# Altium schematic sheet Gestión_Alimentación.SchDoc
size A4; SheetNumber: 9; SheetTotal: 10
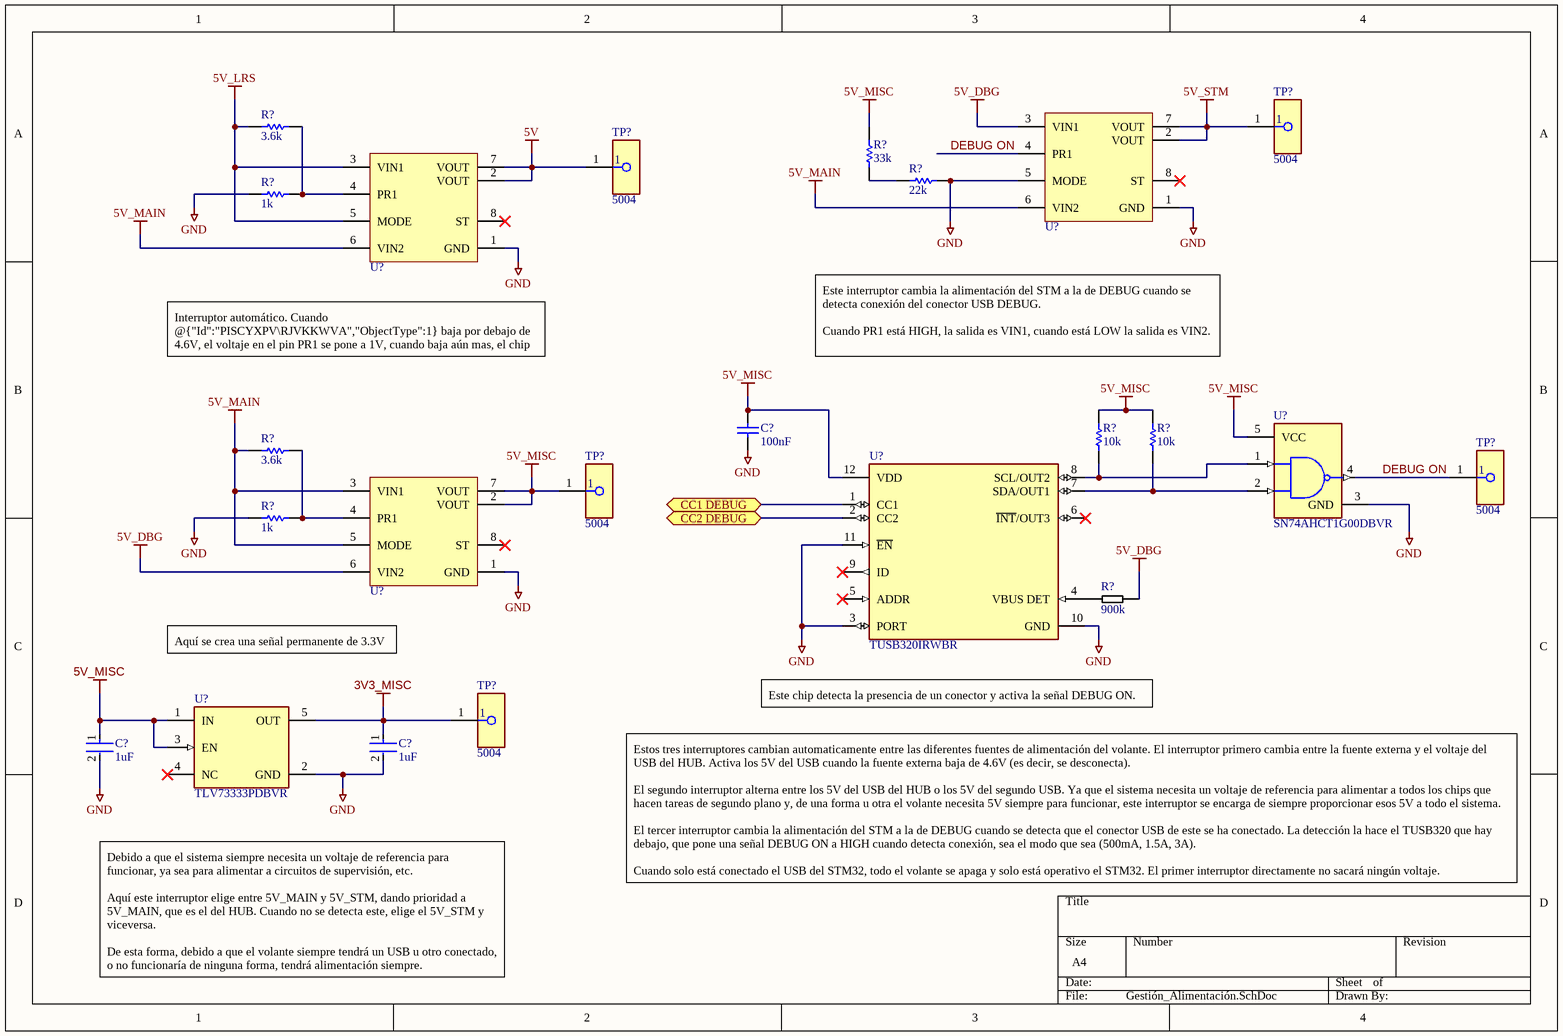
[diagram p0: Gestión_Alimentación.SchDoc]

## Parts
(Parts that share a designator on the sheet are numbered #1, #2 ... from top to bottom, then left to right.)
C?#1  100nF  [CAPC1005X55X25NL05T05]
C?#2  1uF  [FP-C0402C-BB-IPC_B]
C?#3  1uF  [FP-C0402C-BB-IPC_B]
R?#1  3.6k  [RESC1005X40X25ML10T10]
R?#2  33k  [RESC1005X40X25NL10T10]
R?#3  22k  [RESC1005X40X25NL10T10]
R?#4  1k  [RESC1005X40X25NL05T05]
R?#5  3.6k  [RESC1005X40X25ML10T10]
R?#6  10k  [RESC1005X40X25ML05T05]
R?#7  10k  [RESC1005X40X25ML05T05]
R?#8  1k  [RESC1005X40X25NL05T05]
R?#9  900k  [RES 1206]
TP?#1  5004  [FP-5004-MFG]
TP?#2  5004  [FP-5004-MFG]
TP?#3  5004  [FP-5004-MFG]
TP?#4  5004  [FP-5004-MFG]
TP?#5  5004  [FP-5004-MFG]
U?#1  TPS2117DRLR  [TPS2117DRLR]  (value not drawn)
U?#2  TPS2117DRLR  [TPS2117DRLR]  (value not drawn)
U?#3  SN74AHCT1G00DBVR  [FP-DBV0005A-IPC_A]
U?#4  TUSB320IRWBR  [FP-RWB0012A-MFG]
U?#5  TPS2117DRLR  [TPS2117DRLR]  (value not drawn)
U?#6  TLV73333PDBVR  [FP-DBV0005A-MFG]

## Ports
CC1 DEBUG (bidir), CC2 DEBUG (bidir)

## Nets
3V3_MISC: C?#3.1 TP?#5.1 U?#6.5(OUT)
5V: TP?#2.1 U?#2.2(VOUT) U?#2.7(VOUT)
5V_DBG: R?#9.1 U?#1.3(VIN1) U?#5.6(VIN2)
5V_LRS: R?#1.1 U?#2.3(VIN1) U?#2.5(MODE)
5V_MAIN: R?#5.1 U?#1.6(VIN2) U?#2.6(VIN2) U?#5.3(VIN1) U?#5.5(MODE)
5V_MISC: C?#1.2 C?#2.1 R?#2.2 R?#6.2 R?#7.2 TP?#4.1 U?#3.5(VCC) U?#4.12(VDD) U?#5.2(VOUT) U?#5.7(VOUT) U?#6.1(IN) U?#6.3(EN)
5V_STM: TP?#1.1 U?#1.2(VOUT) U?#1.7(VOUT)
GND: C?#1.1 C?#2.2 C?#3.2 R?#3.2 R?#4.1 R?#8.1 U?#1.1(GND) U?#1.5(MODE) U?#2.1(GND) U?#3.3(GND) U?#4.3(PORT) U?#4.10(GND) U?#4.11(~{EN}) U?#5.1(GND) U?#6.2(GND)
CC1 DEBUG: U?#4.1(CC1) ; port CC1 DEBUG
CC2 DEBUG: U?#4.2(CC2) ; port CC2 DEBUG
DEBUG ON: TP?#3.1 U?#1.4(PR1) U?#3.4(Y)
NetR?#1_2: R?#1.2 R?#4.2 U?#2.4(PR1)
NetR?#2_1: R?#2.1 R?#3.1
NetR?#5_2: R?#5.2 R?#8.2 U?#5.4(PR1)
NetR?#6_1: R?#6.1 U?#3.1(A) U?#4.8(SCL/OUT2)
NetR?#7_1: R?#7.1 U?#3.2(B) U?#4.7(SDA/OUT1)
NetR?#9_2: R?#9.2 U?#4.4(VBUS_DET)

Not connected (* = marked no-connect by the designer): U?#1 8(ST)*; U?#2 8(ST)*; U?#4 5(ADDR)* 6(~{INT}/OUT3)* 9(ID)*; U?#5 8(ST)*; U?#6 4(NC)*

## Notes on the sheet
- Interruptor automático. Cuando @{"Id":"PISCYXPV\RJVKKWVA","ObjectType":1} baja por debajo de 4.6V, el voltaje en el pin PR1 se pone a 1V, cuando baja aún mas, el chip cambia la salida a VIN2 y no usa 5V_LRS para ello.
- Este interruptor cambia la alimentación del STM a la de DEBUG cuando se detecta conexión del conector USB DEBUG.
  Cuando PR1 está HIGH, la salida es VIN1, cuando está LOW la salida es VIN2.
- Aquí se crea una señal permanente de 3.3V
- Este chip detecta la presencia de un conector y activa la señal DEBUG ON.
- Estos tres interruptores cambian automaticamente entre las diferentes fuentes de alimentación del volante. El interruptor primero cambia entre la fuente externa y el voltaje del USB del HUB. Activa los 5V del USB cuando la fuente externa baja de 4.6V (es decir, se desconecta).
  El segundo interruptor alterna entre los 5V del USB del HUB o los 5V del segundo USB. Ya que el sistema necesita un voltaje de referencia para alimentar a todos los chips que hacen tareas de segundo plano y, de una forma u otra el volante necesita 5V siempre para funcionar, este interruptor se encarga de siempre proporcionar esos 5V a todo el sistema.
  El tercer interruptor cambia la alimentación del STM a la de DEBUG cuando se detecta que el conector USB de este se ha conectado. La detección la hace el TUSB320 que hay debajo, que pone una señal DEBUG ON a HIGH cuando detecta conexión, sea el modo que sea (500mA, 1.5A, 3A).
  Cuando solo está conectado el USB del STM32, todo el volante se apaga y solo está operativo el STM32. El primer interruptor directamente no sacará ningún voltaje.
- Debido a que el sistema siempre necesita un voltaje de referencia para funcionar, ya sea para alimentar a circuitos de supervisión, etc.
  Aquí este interruptor elige entre 5V_MAIN y 5V_STM, dando prioridad a 5V_MAIN, que es el del HUB. Cuando no se detecta este, elige el 5V_STM y viceversa.
  De esta forma, debido a que el volante siempre tendrá un USB u otro conectado, o no funcionaría de ninguna forma, tendrá alimentación siempre.

## Library data of the parts
C?#1 = CMP-2008-02030-1: Manufacturer: Vitramon; Part Number: VJ0402Y104KXJCW1BC
C?#2 C?#3 = CMP-03020-034679-1: CAP CER 1UF 16V X5R 0402; Dielectric Material: Ceramic; Tolerance: 10%; RoHS Compliant: Yes; Voltage Rating (DC): 16V; Voltage Rating: 16V; Max Operating Temperature: 85°C; Packaging: Cut Tape; Width: 0.02inch; Dielectric: X5R; Lead Free: Lead Free; Min Operating Temperature: -55°C; Mount: Surface Mount; Case/Package: 0402; Thickness: 0.022inch; REACH SVHC: No SVHC; Length: 0.039inch; Case Code (Metric): 1005; Case Code (Imperial): 0402; Capacitance: 1uF
R?#1 R?#5 = CMP-2002-05802-1: Manufacturer: Panasonic; Part Number: ERA-2AEB362X
R?#2 = CMP-2002-05855-1: Part Number: ERA-2AED333X; Manufacturer: Panasonic
R?#3 = CMP-2002-05849-1: Manufacturer: Panasonic; Part Number: ERA-2AED223X
R?#4 R?#8 = CMP-1011-00510-4: Chip Resistor, 1 KOhm, +/- 1%, 100 mW, -55 to 155 degC, 0402 (1005 Metric), RoHS, Tape and Reel; PartNumber: ERJ-2RKF1001X; Manufacturer: Basic Passives; Voltage Rating: 50 V; Case\/Package: 0402; Resistance: 1 KOhm; Power Rating: 100 mW; DatasheetVersion: 04/2015; Radiation Hardening: No; Pins: 2; Height: 0.35 mm; RoHSCompliant: true; Case Code (Imperial): 0402; ComponentLink2Description: Datasheet; ComponentLink1Description: Manufacturer URL; PackageReference: 0402; Mount: Surface Mount; Package Quantity: 10000; Tolerance: 1%; ComponentLink1URL: http://www.panasonic.com/; PackageDescription: 2-Pin Surface Mount Device, Body 1 x 0.5 mm; Mounting Technology: Surface Mount; Case Code (Metric): 1005; ComponentLink2URL: http://industrial.panasonic.com/cdbs/www-data/pdf/RDA0000/AOA0000C86.pdf; REACH SVHC: Yes; Packaging: Tape and Reel; Max Operating Temperature: 155 degC; Min Operating Temperature: -55 degC; Width: 0.5 mm; Length: 1 mm
R?#6 R?#7 = CMP-2002-00601-1: Manufacturer: Panasonic; Part Number: ERJ-2RHD1002X
R?#9 = RT1206CRE07900KL: 900k Resistor 200V 1206 0.5%; Supplier 1: DigiKey; Supplier Part Number 1: 13-RT1206CRE07900KLCT-ND
TP?#1-TP?#5 = CMP-2000-05575-2: PC TEST POINT MINIATURE YELLOW; Manufacturer: Keystone; Number Of Contacts: 1; Is Female: yes; Device Class L1: Connectors; Manufacturer Part Number: 5004; Digikey Description: PC TEST POINT MINIATURE YELLOW; ComponentLink2URL: https://www.keyelco.com/product-pdf.cfm?p=1313; Lead Free: Yes; ComponentLink2Description: Datasheet; Category: Conn; Height: 4.72mm; Octopart: https://octopart.com/5004-keystone-28591; Mouser Description: TEST POINT PC MINI .040"D YELLOW; Device Class L3: unset; Contact Material: Silver; Package: 5004; Automotive: No; Device Class L2: unset; RoHS: TRUE
U?#1 U?#2 U?#5 = TPS2117DRLR: Power Switch ICs - Power Distribution 1.6-V to 5.5-V 20-m ? 4-A low IQ power; Supplier 1: DigiKey; Supplier Part Number 1: 296-TPS2117DRLRCT-ND
U?#3 = CMP-0859-00141-4: IC GATE NAND 1CH 2-INP SOT23-5; Output Current: 8mA; Max Supply Voltage: 5.5V; High Level Output Current: -8mA; Number of Circuits: 1; Schmitt Trigger Input: No; Propagation Delay: 7.9ns; Logic Function: NAND GATE; Min Supply Voltage: 4.5V; Number of Input Lines: 2; Turn-On Delay Time: 9ns; Quiescent Current: 1uA; Length: 2.9mm; Number of Pins: 5; Lead Free: Lead Free; Height: 1.15mm; Case/Package: SOT-23; Termination: SMD/SMT; Packaging: Tape and Reel; Number of Bits: 1; Number of Elements: 1; REACH SVHC: No SVHC; Low Level Output Current: 8mA; Number of Output Lines: 1; Weight: 0.000557oz; Mount: Surface Mount; Max Output Current: 8mA; Max Operating Temperature: 125°C; Contact Plating: Tin; Package Quantity: 1; Min Operating Temperature: -40°C; Number of Outputs: 1; Width: 1.6mm; Radiation Hardening: No; Number of Inputs: 2; Number of Gates: 1
U?#4 = CMP-04877-000006-1: IC INTERFACE SPECIALIZED 12X2QFN; Number of Ports: 1; Max Supply Voltage: 5V; USB Standard: USB 1.1; Interface: I2C; Min Supply Voltage: 2.7V; ESD Protection: Yes; Data Rate: 480Mbps; REACH SVHC: No SVHC; Mount: Surface Mount; Min Operating Temperature: -40°C; Case/Package: TQFP; Lead Free: Lead Free; Length: 1.65mm; Contact Plating: Gold; Height: 0.4mm; Max Operating Temperature: 85°C; Number of Pins: 12; Packaging: Tape and Reel; RoHS Compliant: Yes; Width: 1.65mm
U?#6 = CMP-04917-000053-1: IC REG LINEAR 3.3V 300MA SOT23-5; Manufacturer: Texas Instruments; Max Junction Temp: +125°C; Accuracy Percentage: 1%; Min Supply Voltage: 1.4V; Number Of Outputs: 1; Dropout Voltage: 125mV; Nominal Supply Current: 34uA; Max Supply Voltage: 5.5V; Output Type: Fixed; Standoff Height: 0mm; Digikey Description: IC REG LINEAR 3.3V 300MA SOT23-5; Manufacturer Part Number: TLV73333PDBVR; Temperature Range High: +125°C; Temperature: -40°C to +125°C; Output Current: 300mA; Mouser Description: LDO Voltage Regulators Capacitr-Free 300-mA 5-SOT-23 -40 to 125; Automotive: No; Height: 1.45mm; Device Class L3: Voltage Regulators - Linear; ComponentLink2Description: Datasheet; Device Class L1: Integrated Circuits (ICs); ComponentLink2URL: http://www.ti.com/lit/ds/symlink/tlv733p.pdf; Octopart: https://octopart.com/tlv73333pdbvr-texas+instruments-51080890; Temperature Range Low: -40°C; RoHS: TRUE; Lead Free: Yes; Output Voltage: 3.3V; Package: DBV0005A; Device Class L2: Power Management ICs; Category: IC